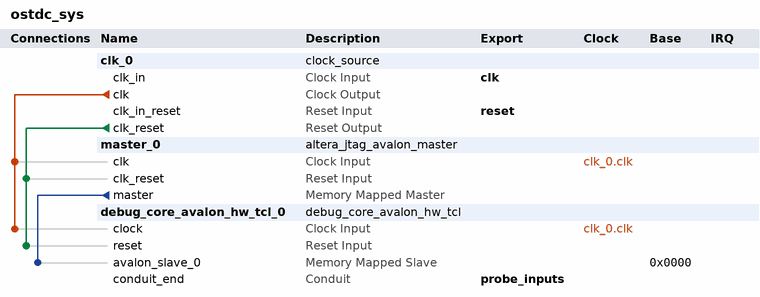
[diagram p0: system contents]
# Platform Designer (Qsys) system ostdc_sys, Cyclone V 5CSXFC6D6F31C6
# Parameters at their usual value, and those the tool derives, are not listed.
package require -exact qsys 25.1
create_system ostdc_sys
set_project_property DEVICE_FAMILY {Cyclone V}
set_project_property DEVICE 5CSXFC6D6F31C6

add_instance clk_0 clock_source 25.1
set_instance_parameter_value clk_0 clockFrequency 50000000

add_instance master_0 altera_jtag_avalon_master 25.1

add_instance debug_core_avalon_hw_tcl_0 debug_core_avalon_hw_tcl 1.0
set_instance_parameter_value debug_core_avalon_hw_tcl_0 BUFFER_DEPTH 256
set_instance_parameter_value debug_core_avalon_hw_tcl_0 DATA_WIDTH 10

# connections
add_connection clk_0.clk debug_core_avalon_hw_tcl_0.clock clock
add_connection clk_0.clk master_0.clk clock
add_connection clk_0.clk_reset debug_core_avalon_hw_tcl_0.reset reset
add_connection clk_0.clk_reset master_0.clk_reset reset
add_connection master_0.master debug_core_avalon_hw_tcl_0.avalon_slave_0 avalon
set_connection_parameter_value master_0.master/debug_core_avalon_hw_tcl_0.avalon_slave_0 baseAddress 0x0000

# exported interfaces
add_interface clk clock sink
set_interface_property clk EXPORT_OF clk_0.clk_in
add_interface probe_inputs conduit end
set_interface_property probe_inputs EXPORT_OF debug_core_avalon_hw_tcl_0.conduit_end
add_interface reset reset sink
set_interface_property reset EXPORT_OF clk_0.clk_in_reset

set_interconnect_requirement {$system} qsys_mm.clockCrossingAdapter HANDSHAKE
set_interconnect_requirement {$system} qsys_mm.enableEccProtection FALSE
set_interconnect_requirement {$system} qsys_mm.insertDefaultSlave FALSE
set_interconnect_requirement {$system} qsys_mm.maxAdditionalLatency 1

save_system ostdc_sys.qsys
